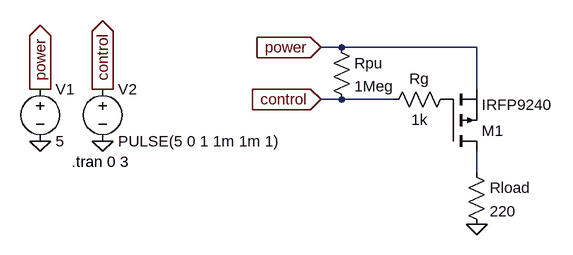
[diagram p0: schematic switch-pmos.asc]
switch-pmos.asc, the LTspice schematic file:
Version 4
SHEET 1 880 680
WIRE 32 80 0 80
WIRE 240 80 32 80
WIRE 240 144 240 80
WIRE 32 160 0 160
WIRE 112 160 32 160
WIRE 240 272 240 240
FLAG 240 352 0
FLAG 0 160 control
IOPIN 0 160 In
FLAG 0 80 power
IOPIN 0 80 In
FLAG -432 224 0
FLAG -432 144 power
IOPIN -432 144 Out
FLAG -336 224 0
FLAG -336 144 control
IOPIN -336 144 Out
SYMBOL Res 224 256 R0
SYMATTR InstName Rload
SYMATTR Value 220
SYMBOL Res 208 144 R90
WINDOW 0 0 56 VBottom 2
WINDOW 3 32 56 VTop 2
SYMATTR InstName Rg
SYMATTR Value 1k
SYMBOL Voltage -432 128 R0
SYMATTR InstName V1
SYMATTR Value 5
SYMBOL Voltage -336 128 R0
SYMATTR InstName V2
SYMATTR Value PULSE(5 0 1 1m 1m 1)
SYMBOL Res 16 64 R0
SYMATTR InstName Rpu
SYMATTR Value 1Meg
SYMBOL pmos 192 240 M180
SYMATTR InstName M1
SYMATTR Value IRFP9240
TEXT -384 256 Left 2 !.tran 0 3

The netlist it stands for:
* switch-pmos.asc
Rload N001 0 220
Rg P001 control 1k
V1 power 0 5
V2 control 0 PULSE(5 0 1 1m 1m 1)
Rpu power control 1Meg
M1 N001 P001 power power IRFP9240
.model NMOS NMOS
.model PMOS PMOS
.lib standard.mos
.tran 0 3
.backanno
.end